# EAGLE design raspi-avr-teletext-2side (EAGLE 6.4)
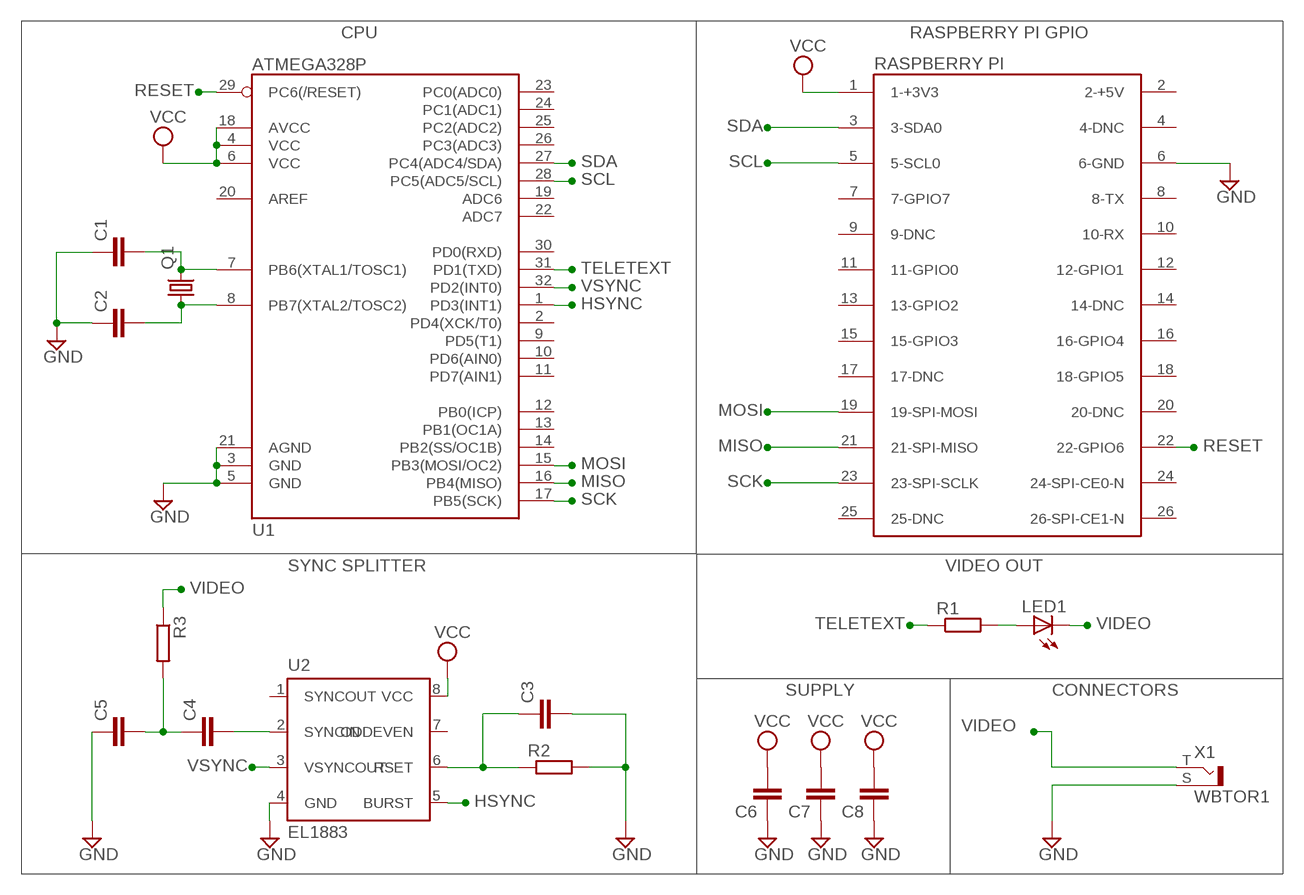
[diagram p0: schematic, sheet 1]

## Parts
C1  C-EUC0603  [C0603]
C2  C-EUC0603  [C0603]
C3  C-EUC0603  [C0603]
C4  C-EUC0603  [C0603]
C5  C-EUC0603  [C0603]
C6  C-EUC0603  [C0603]
C7  C-EUC0603  [C0603]
C8  C-EUC0603  [C0603]
D1  RASPBERRY-PI  [RASPBERRY-PI]
LED1  LEDCHIP-LED0603  [CHIP-LED0603]
Q1  CRYSTALHC49U-V  [HC49U-V]
R1  R-EU_R0603  [R0603]
R2  R-EU_R0603  [R0603]
R3  R-EU_R0603  [R0603]
U1  ATMEGA328P  ATMEGA328_SMT  [TQFP32-08]
U2  EL1883  LM1881M  [SOIC8]
X1  WBTOR1  [WBTOR1]

## Nets
GND: C1.1 C2.1 C3.2 C5.1 C6.1 C7.1 C8.1 D1.6(6-GND) R2.2 U1.3(GND) U1.5(GND) U1.21(AGND) U2.4(GND) X1.S
HSYNC: U1.1(PD3(INT1)) U2.5(BURST)
MISO: D1.21(21-SPI-MISO) U1.16(PB4(MISO))
MOSI: D1.19(19-SPI-MOSI) U1.15(PB3(MOSI/OC2))
N$7: C1.2 Q1.2 U1.7(PB6(XTAL1/TOSC1))
N$8: C2.2 Q1.1 U1.8(PB7(XTAL2/TOSC2))
N$9: C3.1 R2.1 U2.6(RSET)
N$11: LED1.A R1.2
N$12: C4.2 U2.2(SYNCIN)
N$13: C4.1 C5.2 R3.2
RESET: D1.22(22-GPIO6) U1.29(PC6(/RESET))
SCK: D1.23(23-SPI-SCLK) U1.17(PB5(SCK))
SCL: D1.5(5-SCL0) U1.28(PC5(ADC5/SCL))
SDA: D1.3(3-SDA0) U1.27(PC4(ADC4/SDA))
TELETEXT: R1.1 U1.31(PD1(TXD))
VCC: C6.2 C7.2 C8.2 D1.1(1-+3V3) U1.4(VCC) U1.6(VCC) U1.18(AVCC) U2.8(VCC)
VIDEO: LED1.C R3.1 X1.T
VSYNC: U1.32(PD2(INT0)) U2.3(VSYNCOUT)
Unconnected: D1.2(2-+5V) D1.4(4-DNC) D1.7(7-GPIO7) D1.8(8-TX) D1.9(9-DNC) D1.10(10-RX) D1.11(11-GPIO0) D1.12(12-GPIO1) D1.13(13-GPIO2) D1.14(14-DNC) D1.15(15-GPIO3) D1.16(16-GPIO4) D1.17(17-DNC) D1.18(18-GPIO5) D1.20(20-DNC) D1.24(24-SPI-CE0-N) D1.25(25-DNC) D1.26(26-SPI-CE1-N) U1.2(PD4(XCK/T0)) U1.9(PD5(T1)) U1.10(PD6(AIN0)) U1.11(PD7(AIN1)) U1.12(PB0(ICP)) U1.13(PB1(OC1A)) U1.14(PB2(SS/OC1B)) U1.19(ADC6) U1.20(AREF) U1.22(ADC7) U1.23(PC0(ADC0)) U1.24(PC1(ADC1)) U1.25(PC2(ADC2)) U1.26(PC3(ADC3)) U1.30(PD0(RXD)) U2.1(SYNCOUT) U2.7(ODDEVEN)

## Notes on the sheet
- CPU | RASPBERRY PI GPIO
- RASPBERRY PI
- SYNC SPLITTER | VIDEO OUT
- SUPPLY | CONNECTORS

## Library data of the parts
C1-C8 = rcl:C-EU: CAPACITOR, European symbol
D1 = RaspberryPi:RASPBERRY-PI: Raspberry Pi Board <http://www.raspberrypi.org/> Jacques Lagnel V1.0 (beta) 2012 Board dimension: Forum 3D model <http://www.raspberrypi.org/forum/general-discussion/mechanical-profile-3d-models?value=3d%20model&type=1&include=1&search=1&ret=all> The GPIO Connector (P1): http://elinux.org/RPi_Low-level_peripherals
LED1 = led:LED: LED OSRAM: - CHIPLED LG R971, LG N971, LY N971, LG Q971, LY Q971, LO R971, LY R971 LH N974, LH R974 LS Q976, LO Q976, LY Q976 LO Q996 - Hyper CHIPLED LW Q18S LB Q993, LB Q99A, LB R99A - SideLED LS A670, LO A670, LY A670, LG A670, LP A670 LB A673, LV A673, LT A673, LW A673 LH A674 LY A675 LS A676, LA A676, LO A676, LY A676, LW A676 LS A679, LY A679, LG A679 - Hyper Micro SIDELED® LS Y876, LA Y876, LO Y876, LY Y876 LT Y87S - SmartLED LW L88C, LW L88S LB L89C, LB L89S, LG L890 LS L89K, LO L89K, LY L89K LS L896, LA L896, LO L896, LY L896 - TOPLED LS T670, LO T670, LY T670, LG T670, LP T670 LSG T670, LSP T670, LSY T670, LOP T670, LYG T670 LG T671, LOG T671, LSG T671 LB T673, LV T673, LT T673, LW T673 LH T674 LS T676, LA T676, LO T676, LY T676, LB T676, LH T676, LSB T676, LW T676 LB T67C, LV T67C, LT T67C, LS T67K, LO T67K, LY T67K, LW E67C LS E67B, LA E67B, LO E67B, LY E67B, LB E67C, LV E67C, LT E67C LW T67C LS T679, LY T679, LG T679 LS T770, LO T770, LY T770, LG T770, LP T770 LB T773, LV T773, LT T773, LW T773 LH T774 LS E675, LA E675, LY E675, LS T675 LS T776, LA T776, LO T776, LY T776, LB T776 LHGB T686 LT T68C, LB T68C - Hyper Mini TOPLED® LB M676 - Mini TOPLED Santana® LG M470 LS M47K, LO M47K, LY M47K Source: http://www.osram.convergy.de LUXEON: - LUMILED® LXK2-PW12-R00, LXK2-PW12-S00, LXK2-PW14-U00, LXK2-PW14-V00 LXK2-PM12-R00, LXK2-PM12-S00, LXK2-PM14-U00 LXK2-PE12-Q00, LXK2-PE12-R00, LXK2-PE12-S00, LXK2-PE14-T00, LXK2-PE14-U00 LXK2-PB12-K00, LXK2-PB12-L00, LXK2-PB12-M00, LXK2-PB14-N00, LXK2-PB14-P00, LXK2-PB14-Q00 LXK2-PR12-L00, LXK2-PR12-M00, LXK2-PR14-Q00, LXK2-PR14-R00 LXK2-PD12-Q00, LXK2-PD12-R00, LXK2-PD12-S00 LXK2-PH12-R00, LXK2-PH12-S00 LXK2-PL12-P00, LXK2-PL12-Q00, LXK2-PL12-R00 Source: www.luxeon.com KINGBRIGHT: KA-3528ASYC Source: www.kingbright.com
Q1 = crystal:CRYSTAL: CRYSTAL; OC_FARNELL: 1666969; OC_NEWARK: unknown
R1-R3 = rcl:R-EU_: RESISTOR, European symbol
U1 = SparkFun-DigitalIC:ATMEGA328_SMT: 32-Pin Atmega328 part Commonly used on Arduino compatible boards Available in QFP and QFN packages TQFP is IC-09069 QFN is non-stock; PROD_ID: IC-09069
U2 = lm1881:LM1881
X1 = con-lumberg:WBTOR1: RCA connectors according to JEITA RC-5231 Cinch RCA-Einbaukupplung nach JEITA RC-5231, abgewinkelte Ausführung Source: http://www.lumberg.de/Produkte/PDFs/WBTOR1.pdf; MPN: WBTOR 1 BLACK; OC_FARNELL: 1200146; OC_NEWARK: 98K2588

## Board
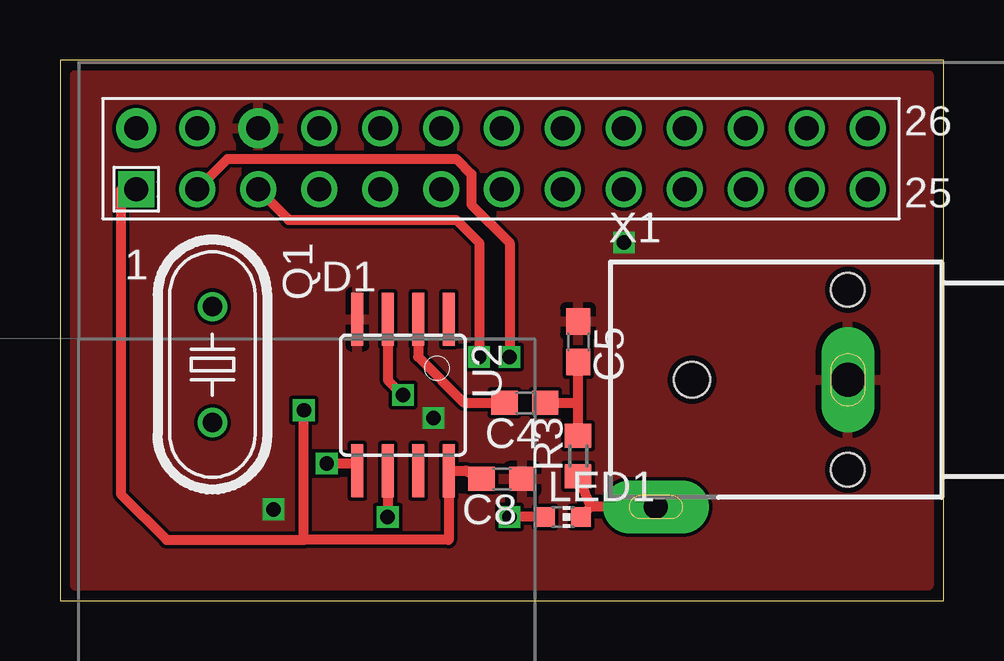
[diagram p1: board, top side]
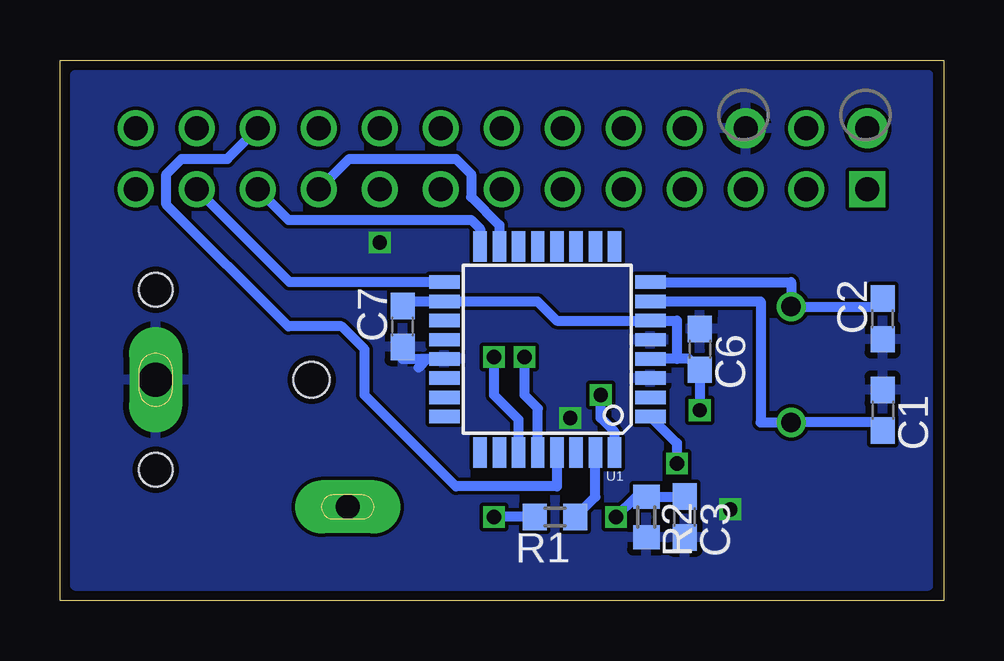
[diagram p2: board, bottom side, seen from below]

Size 36.82 x 22.53 mm. Coordinates in mm from the lower left corner, seen from the top.
Outline: 0,0 36.82,0 36.82,22.53 0,22.53 0,0
Copper layers (1*16): Top 0.035mm / dielectric 0.2mm / Bottom 0.035mm
Design rules "SeeedStudio_DRU_no_angle_20130527 *": minimum track width 6mil, minimum drill 12mil, track to track 6mil, track to pad 6mil, pad to pad 6mil, via to via 6mil, smd to smd 0mil, copper to edge 10mil, drill to drill 10mil, minimum pad ring 6mil, minimum via ring 6mil, stop-mask expansion 2mil, vias tented up to drill 25mil, thermal gap 10mil

### Footprints (pad centres in the part's own frame; a part is rotated, then mirrored left to right if it is on the bottom)
C0603 = smd 1.1 x 1: 1 -0.85,0; 2 0.85,0
RASPBERRY-PI = drill 1 square: 1 0,0 | drill 1 pad 1.676: 2 0,2.54; 6 5.08,2.54 | drill 1: 3 2.54,0; 4 2.54,2.54; 5 5.08,0; 7 7.62,0; 8 7.62,2.54; 9 10.16,0; 10 10.16,2.54; 11 12.7,0; 12 12.7,2.54; 13 15.24,0; 14 15.24,2.54; 15 17.78,0; 16 17.78,2.54; 17 20.32,0; 18 20.32,2.54; 19 22.86,0; 20 22.86,2.54; 21 25.4,0; 22 25.4,2.54; 23 27.94,0; 24 27.94,2.54; 25 30.48,0; 26 30.48,2.54
CHIP-LED0603 = smd 0.8 x 0.8: A 0,-0.75; C 0,0.75
HC49U-V = drill 0.813: 1 -2.413,0; 2 2.413,0
R0603 = smd 1 x 1.1: 1 -0.85,0; 2 0.85,0
TQFP32-08 = smd 1.27 x 0.559: 1 -4.293,2.8; 2 -4.293,2; 3 -4.293,1.2; 4 -4.293,0.4; 5 -4.293,-0.4; 6 -4.293,-1.2; 7 -4.293,-2; 8 -4.293,-2.8; 17 4.293,-2.8; 18 4.293,-2; 19 4.293,-1.2; 20 4.293,-0.4; 21 4.293,0.4; 22 4.293,1.2; 23 4.293,2; 24 4.293,2.8 | smd 0.559 x 1.27: 9 -2.8,-4.293; 10 -2,-4.293; 11 -1.2,-4.293; 12 -0.4,-4.293; 13 0.4,-4.293; 14 1.2,-4.293; 15 2,-4.293; 16 2.8,-4.293; 25 2.8,4.293; 26 2,4.293; 27 1.2,4.293; 28 0.4,4.293; 29 -0.4,4.293; 30 -1.2,4.293; 31 -2,4.293; 32 -2.8,4.293
SOIC8 = smd 0.5 x 2.2: 1 -1.905,-3.154; 2 -0.645,-3.154; 3 0.625,-3.154; 4 1.895,-3.154; 5 1.905,3.154; 6 0.635,3.154; 7 -0.635,3.154; 8 -1.905,3.154
WBTOR1 = drill 1.4 pad 2.2 long: S 0,-4 | drill 1 pad 2.2 long: T 5.3,-12 | hole 1.4: -3.75,-4; 3.75,-4 | hole 1.5: 0,-10.5

### Placement (x,y rotation side)
C1  2.54,7.94 270 bottom
C2  2.54,11.75 90 bottom
C3  10.8,3.49 270 bottom
C4  19.37,8.25 180 top
C5  21.59,10.79 270 top
C6  10.16,10.48 270 bottom
C7  22.54,11.43 90 bottom
C8  18.41,5.08 180 top
D1  3.18,17.15 0 top
LED1  20.96,3.49 270 top
Q1  6.35,9.84 270 top
R1  16.19,3.49 180 bottom
R2  12.38,3.49 270 bottom
R3  21.59,6.03 90 top
U1  16.51,10.48 180 bottom
U2  14.29,8.57 180 top
X1  36.83,9.21 270 top

### Tracks (layer width: path | path; a pad name or v marks a point on that pad's centre or on a via)
GND  (via drill 0.6)
  Bottom 0.406: 20.86,10.06 21.53,10.06 | 21.53,10.06 21.88,9.72 | 21.53,10.06 22.54,10.06 C7.1
  other vias: 23.5,14.92 8.89,3.81 15.56,7.62
  pour Bottom: 0.63,21.91 36.19,21.91 36.19,0.63 0.63,0.63
  pour Top: 0.63,21.91 36.19,21.91 36.19,0.63 0.63,0.63
HSYNC  (via drill 0.6)
  Top 0.406: U2.5 12.38,5.71 v11.11,5.71
  Bottom 0.406: U1.1 11.11,6.57 v11.11,5.71
MISO
  Bottom 0.406: U1.16 19.31,15.5 19.68,15.87 27.31,15.87 D1.21
MOSI
  Bottom 0.406: U1.15 18.51,15.65 19.68,16.83 19.68,17.78 20.32,18.41 24.77,18.41 D1.19
N$7
  Bottom 0.406: U1.7 7.62,12.48 7.62,7.43 Q1.2 2.54,7.43 C1.2
N$8
  Bottom 0.406: U1.8 6.35,13.28 Q1.1 2.54,12.26 C2.2
N$9  (via drill 0.6)
  Top 0.406: U2.6 v13.65,3.49
  Bottom 0.406: C3.1 R2.1 12.8,4.34 v13.65,3.49
N$11  (via drill 0.6)
  Top 0.406: LED1.A v18.73,3.49
  Bottom 0.406: R1.2 v18.73,3.49
N$12
  Top 0.406: U2.2 14.93,10.57 14.92,10.16 16.83,8.25 C4.2
N$13
  Top 0.406: R3.2 21.59,8.25 | 21.59,8.25 C5.2 | C4.1 21.59,8.25
RESET
  Bottom 0.406: U1.29 16.11,4.76 20.32,4.76 24.13,8.57 24.13,10.48 25.08,11.43 27.31,11.43 32.39,16.51 32.39,17.78 31.75,18.41 29.85,18.41 D1.22
SCK
  Bottom 0.406: U1.17 27.25,13.28 D1.23
SCL  (via drill 0.6)
  Top 0.406: D1.5 9.53,15.87 16.51,15.87 17.46,14.92 v17.46,10.16
  Bottom 0.406: U1.28 16.91,8.02 17.46,8.57 v17.46,10.16
SDA  (via drill 0.6)
  Top 0.406: D1.3 6.98,18.41 16.51,18.41 17.14,17.78 17.14,16.51 18.73,14.92 v18.73,10.16
  Bottom 0.406: U1.27 17.71,7.55 18.73,8.57 v18.73,10.16
TELETEXT
  Bottom 0.406: R1.1 14.51,4.32 U1.31
VCC  (via drill 0.6)
  Top 0.406: D1.1 2.54,17.15 2.54,4.45 4.45,2.54 10.16,2.54 | 10.16,2.54 v10.16,7.94 | 10.16,2.54 16.19,2.54 U2.8 16.91,5.42 C8.2
  Bottom 0.406: 11.11,10.08 10.61,10.08 C6.2 v10.16,7.94 | 11.11,10.08 U1.4 | 11.11,10.08 11.11,11.68 U1.6 16.12,11.68 16.92,12.48 U1.18 22.66,12.48 C7.2
VIDEO
  Top 0.406: LED1.C 22.12,3.91 | 22.12,3.91 R3.1 | X1.T 22.12,3.91
VSYNC  (via drill 0.6)
  Top 0.406: U2.3 13.66,9.2 v14.29,8.57
  Bottom 0.406: U1.32 13.71,7.04 14.29,7.62 v14.29,8.57